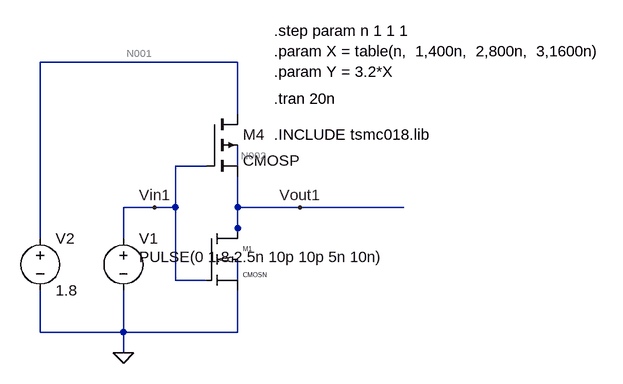
[diagram p0: schematic VTC_CMOS_CURRENT_WITHOUT_C.asc]
VTC_CMOS_CURRENT_WITHOUT_C.asc, the LTspice schematic file:
Version 4
SHEET 1 2184 1940
WIRE -528 -64 -832 -64
WIRE -528 16 -528 -64
WIRE -576 96 -624 96
WIRE -528 96 -528 64
WIRE -656 160 -704 160
WIRE -624 160 -624 96
WIRE -624 160 -656 160
WIRE -528 160 -528 112
WIRE -432 160 -528 160
WIRE -272 160 -432 160
WIRE -528 192 -528 160
WIRE -832 208 -832 -64
WIRE -704 208 -704 160
WIRE -528 208 -528 192
WIRE -624 272 -624 160
WIRE -576 272 -624 272
WIRE -528 272 -528 240
WIRE -832 352 -832 288
WIRE -704 352 -704 288
WIRE -704 352 -832 352
WIRE -528 352 -528 288
WIRE -528 352 -704 352
WIRE -704 384 -704 352
FLAG -704 384 0
FLAG -656 160 Vin1
FLAG -432 160 Vout1
DATAFLAG -624 96 ""
SYMBOL voltage -704 192 R0
WINDOW 123 0 0 Left 0
WINDOW 39 0 0 Left 0
WINDOW 3 24 44 Left 2
SYMATTR Value PULSE(0 1.8 2.5n 10p 10p 5n 10n)
SYMATTR InstName V1
SYMBOL voltage -832 192 R0
WINDOW 123 0 0 Left 0
WINDOW 39 0 0 Left 0
SYMATTR InstName V2
SYMATTR Value 1.8
SYMBOL cmosn -576 192 R0
SYMATTR InstName M1
SYMATTR Value2 l=180n w=X
SYMBOL cmosp -576 16 R0
SYMATTR InstName M4
SYMATTR Value2 l=180n w=Y
TEXT -472 48 Left 2 !.INCLUDE tsmc018.lib
TEXT -472 -112 Left 2 !.step param n 1 1 1\n.param X = table(n,  1,400n,  2,800n,  3,1600n)\n.param Y = 3.2*X
TEXT -472 -8 Left 2 !.tran 20n

The netlist it stands for:
* VTC_CMOS_CURRENT_WITHOUT_C.asc
V1 Vin1 0 PULSE(0 1.8 2.5n 10p 10p 5n 10n)
V2 N001 0 1.8
M1 Vout1 Vin1 0 N003 CMOSN l=180n w=X
M4 N001 Vin1 Vout1 N002 CMOSP l=180n w=Y
.model NMOS NMOS
.model PMOS PMOS
.lib standard.mos
.INCLUDE tsmc018.lib
.step param n 1 1 1
.param X = table(n,  1,400n,  2,800n,  3,1600n)
.param Y = 3.2*X
.tran 20n
.lib tsmc018.lib
.backanno
.end

* Results of the author's LTspice run, read from the files saved beside the schematic
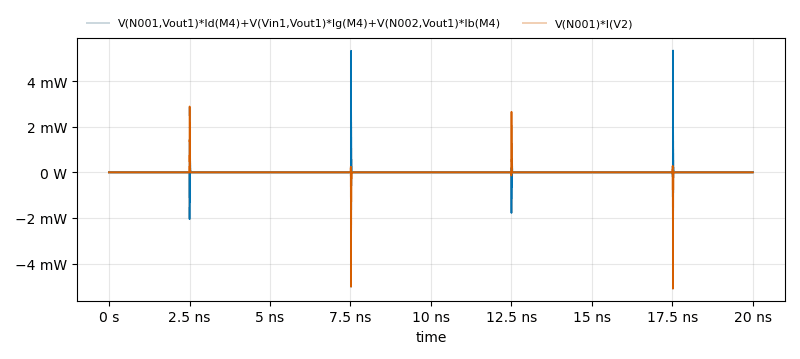
[diagram p1: Transient Analysis of VTC_CMOS_CURRENT_WITHOUT_C.asc, plotted from the saved traces]
* Transient Analysis, 3 runs:
*   V(N001,Vout1)*Id(M4)+V(Vin1,Vout1)*Ig(M4)+V(N002,Vout1)*Ib(M4) [run 1]: min -518.2 µW, max 1.326 mW, average 726.4 nW, rms 26.73 µW, last 0 W
*   V(N001,Vout1)*Id(M4)+V(Vin1,Vout1)*Ig(M4)+V(N002,Vout1)*Ib(M4) [run 2]: min -1.098 mW, max 2.69 mW, average 1.266 µW, rms 54.9 µW, last 0 W
*   V(N001,Vout1)*Id(M4)+V(Vin1,Vout1)*Ig(M4)+V(N002,Vout1)*Ib(M4) [run 3]: min -2.052 mW, max 5.352 mW, average 2.641 µW, rms 106.9 µW, last 0 W
*   V(N001)*I(V2) [run 1]: min -1.259 mW, max 777.7 µW, average -582.3 nW, rms 33.14 µW, last 0 W
*   V(N001)*I(V2) [run 2]: min -2.568 mW, max 1.446 mW, average -1.209 µW, rms 67.15 µW, last 0 W
*   V(N001)*I(V2) [run 3]: min -5.109 mW, max 2.89 mW, average -2.187 µW, rms 133.4 µW, last 0 W